# Altium project soldering.PrjPcb
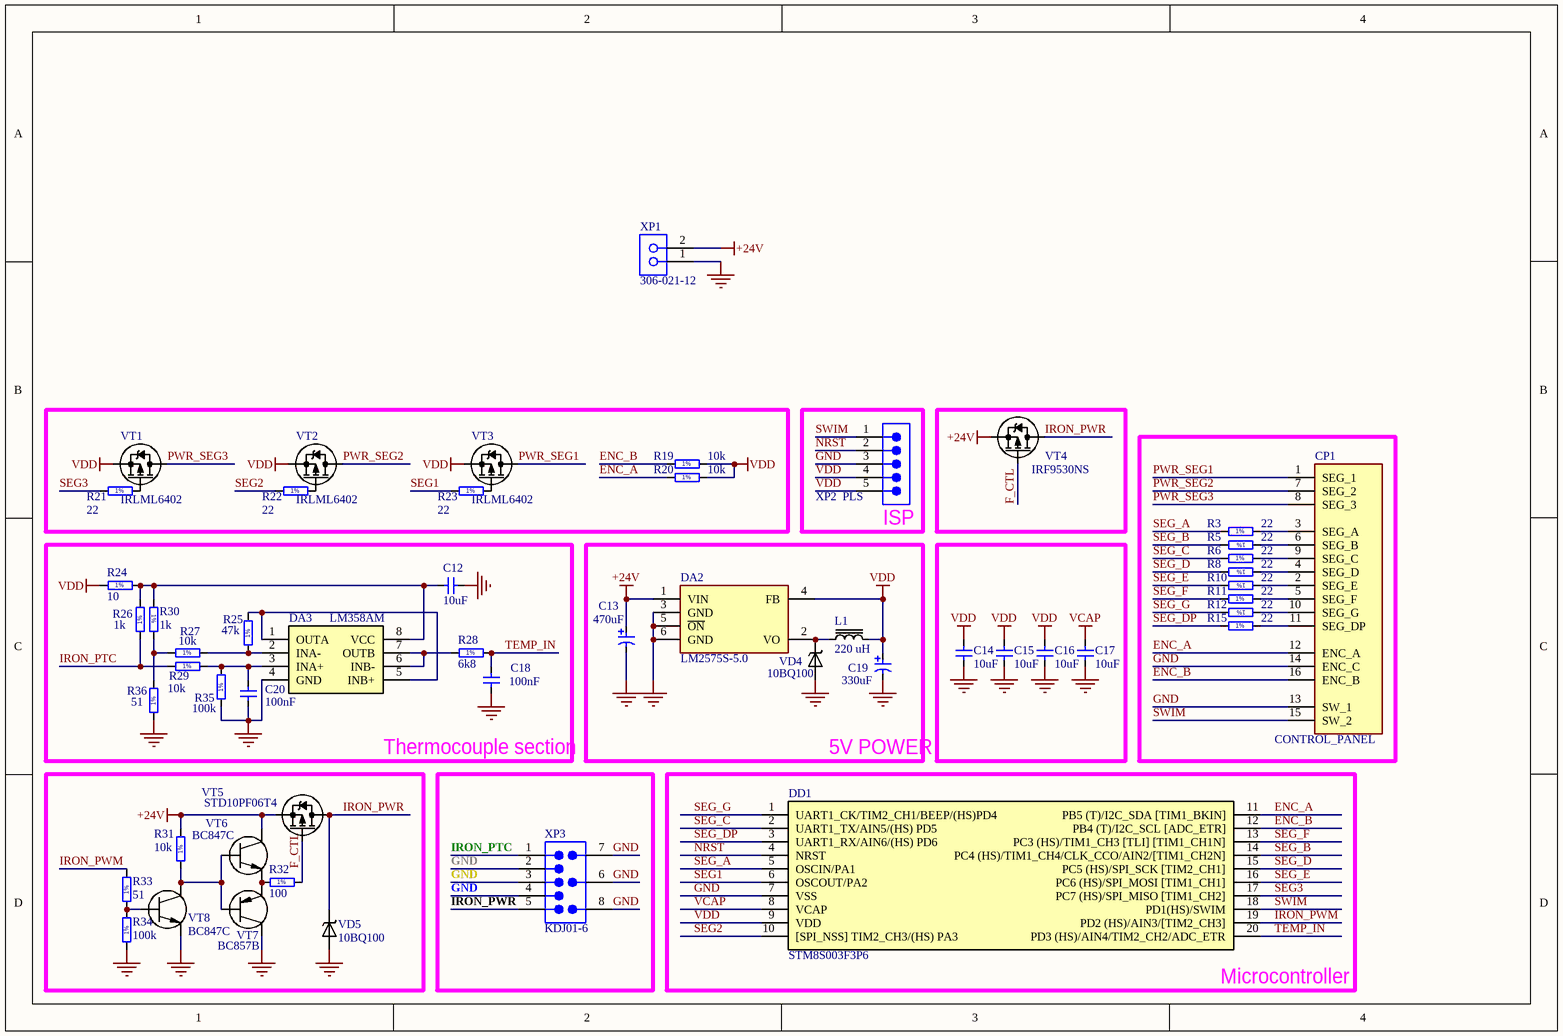
[diagram p0: soldering.SchDoc]
1 sheet, 53 parts. Net scope: global (net labels, ports and power ports of the same name join across sheets).
Board file: soldering.PcbDoc

## Sheet soldering.SchDoc
size A4

### Parts
C12  10uF  [CAP0805R]
C13  470uF  [CAP_EL_10_19_VERT]
C14  10uF  [CAP0805R]
C15  10uF  [CAP0805R]
C16  10uF  [CAP0805R]
C17  10uF  [CAP0805R]
C18  100nF  [CAP0805R]
C19  330uF  [TAN_D]
C20  100nF  [CAP0805R]
CP1  CONTROL_PANEL  [CONTROL_PANEL]
DA2  LM2575S-5.0  [TO-263-5]
DA3  OP Amp  [SOP8]  (value not drawn)
DD1  8 Bit MCU  [TSSOP20]  (value not drawn)
L1  220 uH  [SL1016]
R3  22  [RES0805R]
R5  22  [RES0805R]
R6  22  [RES0805R]
R8  22  [RES0805R]
R10  22  [RES0805R]
R11  22  [RES0805R]
R12  22  [RES0805R]
R15  22  [RES0805R]
R19  10k  [RES0805R]
R20  10k  [RES0805R]
R21  22  [RES0805R]
R22  22  [RES0805R]
R23  22  [RES0805R]
R24  10  [RES0805R]
R25  47k  [RES0805R]
R26  1k  [RES0805R]
R27  10k  [RES0805R]
R28  6k8  [RES0805R]
R29  10k  [RES0805R]
R30  1k  [RES0805R]
R31  10k  [RES0805R]
R32  100  [RES0805R]
R33  51  [RES0805R]
R34  100k  [RES0805R]
R35  100k  [RES0805R]
R36  51  [RES0805R]
VD4  10BQ100  [DO-214AA]
VD5  10BQ100  [DO-214AA]
VT1  IRLML6402  [SOT23]
VT2  IRLML6402  [SOT23]
VT3  IRLML6402  [SOT23]
VT4  IRF9530NS  [D2PAK]
VT5  STD10PF06T4  [DPAK]
VT6  BC847C  [SOT23]
VT7  BC857B  [SOT23]
VT8  BC847C  [SOT23]
XP1  306-021-12  [306-021-12]
XP2  PLS  [PLS-05]
XP3  KDJ01-6  [KDJ01-6]

### Blocks framed on the sheet
ISP: XP2
5V POWER: C13 C19 DA2 L1 VD4
Thermocouple section: R31-R34 VD5 VT5-VT8
Microcontroller: DD1

### Nets
+24V: C13.2 DA2.1(VIN) R31.2 VT4.2(S) VT5.2(S) VT6.3(C) XP1.2
GND: C12.2 C13.1 C14.1 C15.1 C16.1 C17.1 C18.1 C19.1 C20.1 CP1.13(SW_1) CP1.14(ENC_C) DA2.3(GND) DA2.5(~{ON}) DA2.6(GND) DA3.4(GND) DD1.7(VSS) R34.1 R35.1 R36.1 VD4.A VD5.A VT7.3(C) VT8.2(E) XP1.1 XP2.3 XP3.2 XP3.3 XP3.4 XP3.6 XP3.7 XP3.8
VCAP: C17.2 DD1.8(VCAP)
VDD: C14.2 C15.2 C16.2 C19.2 DA2.4(FB) DD1.9(VDD) L1.2 R19.2 R20.2 R24.1 VT1.2(S) VT2.2(S) VT3.2(S) XP2.4 XP2.5
ENC_A: CP1.12(ENC_A) DD1.11(PB5_(T)/I2C_SDA_[TIM1_BKIN]) R20.1
ENC_B: CP1.16(ENC_B) DD1.12(PB4_(T)/I2C_SCL_[ADC_ETR]) R19.1
F_CTL: R32.2 VT4.1(G) VT5.1(G)
IRON_PTC: R26.1 R29.1 XP3.1
IRON_PWM: DD1.19(PD2_(HS)/AIN3/[TIM2_CH3]) R33.2
IRON_PWR: VD5.K VT4.3(D) VT5.3(D) XP3.5
NRST: DD1.4(NRST) XP2.2
PWR_SEG1: CP1.1(SEG_1) VT3.3(D)
PWR_SEG2: CP1.7(SEG_2) VT2.3(D)
PWR_SEG3: CP1.8(SEG_3) VT1.3(D)
SEG1: DD1.6(OSCOUT/PA2) R23.1
SEG2: DD1.10([SPI_NSS]_TIM2_CH3/(HS)_PA3) R22.1
SEG3: DD1.17(PC7_(HS)/SPI_MISO_[TIM1_CH2]) R21.1
SEG_A: DD1.5(OSCIN/PA1) R3.1
SEG_B: DD1.14(PC4_(HS)/TIM1_CH4/CLK_CCO/AIN2/[TIM1_CH2N]) R5.2
SEG_C: DD1.2(UART1_TX/AIN5/(HS)_PD5) R6.1
SEG_D: DD1.15(PC5_(HS)/SPI_SCK_[TIM2_CH1]) R8.2
SEG_DP: DD1.3(UART1_RX/AIN6/(HS)_PD6) R15.1
SEG_E: DD1.16(PC6_(HS)/SPI_MOSI_[TIM1_CH1]) R10.2
SEG_F: DD1.13(PC3_(HS)/TIM1_CH3_[TLI]_[TIM1_CH1N]) R11.1
SEG_G: DD1.1(UART1_CK/TIM2_CH1/BEEP/(HS)PD4) R12.2
SWIM: CP1.15(SW_2) DD1.18(PD1(HS)/SWIM) XP2.1
TEMP_IN: C18.2 DD1.20(PD3_(HS)/AIN4/TIM2_CH2/ADC_ETR) R28.2
NetC12_1: C12.1 DA3.8(VCC) R24.2 R26.2 R30.1
NetC20_2: C20.2 DA3.3(INA+) R29.2 R35.2
NetCP1_2: CP1.2(SEG_E) R10.1
NetCP1_3: CP1.3(SEG_A) R3.2
NetCP1_4: CP1.4(SEG_D) R8.1
NetCP1_5: CP1.5(SEG_F) R11.2
NetCP1_6: CP1.6(SEG_B) R5.1
NetCP1_9: CP1.9(SEG_C) R6.2
NetCP1_10: CP1.10(SEG_G) R12.1
NetCP1_11: CP1.11(SEG_DP) R15.2
NetDA2_2: DA2.2(VO) L1.1 VD4.K
NetDA3_1: DA3.1(OUTA) DA3.5(INB+) R25.2
NetDA3_2: DA3.2(INA-) R25.1 R27.2
NetDA3_6: DA3.6(INB-) DA3.7(OUTB) R28.1
NetR21_2: R21.2 VT1.1(G)
NetR22_2: R22.2 VT2.1(G)
NetR23_2: R23.2 VT3.1(G)
NetR27_1: R27.1 R30.2 R36.2
NetR31_1: R31.1 VT6.1(B) VT7.1(B) VT8.3(C)
NetR32_1: R32.1 VT6.2(E) VT7.2(E)
NetR33_1: R33.1 R34.2 VT8.1(B)

### Notes on the sheet
- (in symbol R0805_1K_1%_0.125W_100PPM) 1%
- (in symbol R0805_6K8_1%_0.125W_100PPM) 1%
- (in symbol R0805_10K_1%_0.125W_100PPM) 1%
- (in symbol R0805_10R_1%_0.125W_200PPM) 1%
- (in symbol R0805_22R_1%_0.125W_100PPM) 1%
- (in symbol R0805_47K_1%_0.125W_100PPM) 1%
- (in symbol R0805_51R_1%_0.125W_100PPM) 1%
- (in symbol R0805_100K_1%_0.125W_100PPM) 1%
- (in symbol R0805_100R_1%_0.125W_100PPM) 1%

### Library data of the parts
C12 C14-C17 = CC0805_10UF_10V_10%_X7R: SMD 0805 Capacitor; Part Description: SMD Multilayer Chip Ceramic Capacitor; Manufacturer: GENERIC; Manufacturer1 Part Number: GRM21BR71A106KE51L; Voltage: 10V; TC: X7R; Tolerance: ±10%; Table: Capacitors SMD; Part Number: CC0805_10UF_10V_10%_X7R; Component Kind: Standard; Component Type: Standard; Pin Count: 2; Value: 10uF; Status: Preferred; Manufacturer Part Number: CC0805_10UF_10V_10%_X7R; Case: 0805; Mounted: Yes; Socket: No; SMD: Yes; Manufacturer1 Example: MURATA; Manufacturer1 ComponentHeight: 1.35mm; HelpURL: \\cern.ch\dfs\Applications\Altium\Datasheets\CC0805_X7R_MURATA.pdf; Author: I. Kuznetsov; CreateDate: 30.04.2012; LatestRevisionDate: 30.04.2012
C13 = SH050M0470B5S-1019 (VERT MOUNTED): Voltage: 50V; Table: Electrolytic THD; Part Number: SH050M0470B5S-1019 (VERT MOUNTED); Value: 470uF
C18 C20 = CC0805_100NF_50V_10%_X7R: SMD 0805 Capacitor; Part Description: SMD Multilayer Chip Ceramic Capacitor; Manufacturer: GENERIC; Manufacturer1 Part Number: B37941K5104K62; Voltage: 50V; TC: X7R; Tolerance: ±10%; Table: Capacitors SMD; Part Number: CC0805_100NF_50V_10%_X7R; Component Kind: Standard; Component Type: Standard; Pin Count: 2; Value: 100nF; Status: Preferred; Manufacturer Part Number: CC0805_100NF_50V_10%_X7R; Case: 0805; Mounted: Yes; Socket: No; SMD: Yes; Manufacturer1 Example: EPCOS; Manufacturer1 ComponentHeight: 1.35mm; HelpURL: \\cern.ch\dfs\Applications\Altium\Datasheets\CC0805_X7R_EPCOS.pdf; Author: I. Kuznetsov; CreateDate: 03.12.2007; LatestRevisionDate: 03.12.2007
C19 = T495D337M010AHE100: Voltage: 10V; Table: Tantalum; Part Number: T495D337M010AHE100; Value: 330uF
DA2 = LM2575S-5.0: Manufacturer: TI; Table: Regulators; Part Number: LM2575S-5.0; Component Kind: Standard; Component Type: Standard; Device: LM2575S-5.0; Status: Active; Manufacturer Part Number: LM2575S-5.0; Pin Count: 6; Case: TO-263-5; Mounted: Yes; Socket: No; SMD: Yes; Author: I. Kuznetsov
DA3 = LM358AM: PartNumber: LM358AM
DD1 = STM8S003F3P6: 8 Bit MCU (STmicroelectronics); PartNumber: STM8S003F3P6
L1 = SL1016T-4R7K-B-N: Tolerance: ± 10%; Table: Inductors THD; Part Number: SL1016T-4R7K-B-N; Value: 220 uH
R3 R5 R6 R8 R10-R12 R15 R21-R23 = R0805_22R_1%_0.125W_100PPM: Part Description: General Purpose Thick Film Chip Resistor; Manufacturer: GENERIC; Manufacturer1 Part Number: NRC10F22R0TRF; Power: 0.125W; TC: ±100ppm/°C; Tolerance: ±1%; Table: Resistors SMD; Part Number: R0805_22R_1%_0.125W_100PPM; Component Kind: Standard; Component Type: Standard; Footprint: RESC2012X60N; Pin Count: 2; Value: 22; Status: Preferred; Manufacturer Part Number: R0805_22R_1%_0.125W_100PPM; Case: 0805; Mounted: Yes; Socket: No; SMD: Yes; Manufacturer1 Example: NIC COMPONENT; Manufacturer1 ComponentHeight: 0.6mm; HelpURL: \\cern.ch\dfs\Applications\Altium\Datasheets\R0805_NIC_NRC.pdf; Author: CERN DEM JLC; CreateDate: 03.12.2007; LatestRevisionDate: 13.03.2008
R19 R20 R27 R29 R31 = R0805_10K_1%_0.125W_100PPM: Part Description: General Purpose Thick Film Chip Resistor; Manufacturer: GENERIC; Manufacturer1 Part Number: NRC10F1002TRF; Power: 0.125W; TC: ±100ppm/°C; Tolerance: ±1%; Table: Resistors SMD; Part Number: R0805_10K_1%_0.125W_100PPM; Component Kind: Standard; Component Type: Standard; Footprint: RESC2012X60N; Pin Count: 2; Value: 10k; Status: Preferred; Manufacturer Part Number: R0805_10K_1%_0.125W_100PPM; Case: 0805; Mounted: Yes; Socket: No; SMD: Yes; Manufacturer1 Example: NIC COMPONENT; Manufacturer1 ComponentHeight: 0.6mm; HelpURL: \\cern.ch\dfs\Applications\Altium\Datasheets\R0805_NIC_NRC.pdf; Author: CERN DEM JLC
  R19 R20 R31: CreateDate: 03.12.2007; LatestRevisionDate: 13.03.2008
  R27 R29: CreateDate: 12/3/2007; LatestRevisionDate: 3/13/2008; PackageDescription: Standard
R24 = R0805_10R_1%_0.125W_200PPM: Part Description: General Purpose Thick Film Chip Resistor; Manufacturer: GENERIC; Manufacturer1 Part Number: NRC10F10R0TRF; Power: 0.125W; TC: ±200ppm/°C; Tolerance: ±1%; Table: Resistors SMD; Part Number: R0805_10R_1%_0.125W_200PPM; Component Kind: Standard; Component Type: Standard; Footprint: RESC2012X60N; Pin Count: 2; Value: 10; Status: Preferred; Manufacturer Part Number: R0805_10R_1%_0.125W_200PPM; Case: 0805; Mounted: Yes; Socket: No; SMD: Yes; Manufacturer1 Example: NIC COMPONENT; Manufacturer1 ComponentHeight: 0.6mm; HelpURL: \\cern.ch\dfs\Applications\Altium\Datasheets\R0805_NIC_NRC.pdf; Author: CERN DEM JLC; CreateDate: 03.12.2007; LatestRevisionDate: 24.06.2009
R25 = R0805_47K_1%_0.125W_100PPM: Part Description: General Purpose Thick Film Chip Resistor; Manufacturer: GENERIC; Manufacturer1 Part Number: NRC10F4702TRF; Power: 0.125W; TC: ±100ppm/°C; Tolerance: ±1%; Table: Resistors SMD; Part Number: R0805_47K_1%_0.125W_100PPM; Component Kind: Standard; Component Type: Standard; Footprint: RESC2012X60N; Pin Count: 2; Value: 47k; Status: Preferred; Manufacturer Part Number: R0805_47K_1%_0.125W_100PPM; Case: 0805; Mounted: Yes; Socket: No; SMD: Yes; Manufacturer1 Example: NIC COMPONENT; Manufacturer1 ComponentHeight: 0.6mm; HelpURL: \\cern.ch\dfs\Applications\Altium\Datasheets\R0805_NIC_NRC.pdf; Author: CERN DEM JLC; CreateDate: 12/3/2007; LatestRevisionDate: 3/13/2008; PackageDescription: Standard
R26 R30 = R0805_1K_1%_0.125W_100PPM: Part Description: General Purpose Thick Film Chip Resistor; Manufacturer: GENERIC; Manufacturer1 Part Number: NRC10F1001TRF; Power: 0.125W; TC: ±100ppm/°C; Tolerance: ±1%; Table: Resistors SMD; Part Number: R0805_1K_1%_0.125W_100PPM; Component Kind: Standard; Component Type: Standard; Footprint: RESC2012X60N; Pin Count: 2; Value: 1k; Status: Preferred; Manufacturer Part Number: R0805_1K_1%_0.125W_100PPM; Case: 0805; Mounted: Yes; Socket: No; SMD: Yes; Manufacturer1 Example: NIC COMPONENT; Manufacturer1 ComponentHeight: 0.6mm; HelpURL: \\cern.ch\dfs\Applications\Altium\Datasheets\R0805_NIC_NRC.pdf; Author: CERN DEM JLC
  R26: CreateDate: 12/3/2007; LatestRevisionDate: 3/13/2008; PackageDescription: Standard
  R30: CreateDate: 03.12.2007; LatestRevisionDate: 13.03.2008
R28 = R0805_6K8_1%_0.125W_100PPM: Part Description: General Purpose Thick Film Chip Resistor; Manufacturer: GENERIC; Manufacturer1 Part Number: NRC10F6801TRF; Power: 0.125W; TC: ±100ppm/°C; Tolerance: ±1%; Table: Resistors SMD; Part Number: R0805_6K8_1%_0.125W_100PPM; Component Kind: Standard; Component Type: Standard; Footprint: RESC2012X60N; Pin Count: 2; Value: 6k8; Status: Preferred; Manufacturer Part Number: R0805_6K8_1%_0.125W_100PPM; Case: 0805; Mounted: Yes; Socket: No; SMD: Yes; Manufacturer1 Example: NIC COMPONENT; Manufacturer1 ComponentHeight: 0.6mm; HelpURL: \\cern.ch\dfs\Applications\Altium\Datasheets\R0805_NIC_NRC.pdf; Author: CERN DEM JLC; CreateDate: 03.12.2007; LatestRevisionDate: 13.03.2008
R32 = R0805_100R_1%_0.125W_100PPM: Part Description: General Purpose Thick Film Chip Resistor; Manufacturer: GENERIC; Manufacturer1 Part Number: NRC10F4700TRF; Power: 0.125W; TC: ±100ppm/°C; Tolerance: ±1%; Table: Resistors SMD; Part Number: R0805_100R_1%_0.125W_100PPM; Component Kind: Standard; Component Type: Standard; Footprint: RESC2012X60N; Pin Count: 2; Value: 100; Status: Preferred; Manufacturer Part Number: R0805_100R_1%_0.125W_100PPM; Case: 0805; Mounted: Yes; Socket: No; SMD: Yes; Manufacturer1 Example: NIC COMPONENT; Manufacturer1 ComponentHeight: 0.6mm; HelpURL: \\cern.ch\dfs\Applications\Altium\Datasheets\R0805_NIC_NRC.pdf; Author: CERN DEM JLC; CreateDate: 03.12.2007; LatestRevisionDate: 13.03.2008
R33 R36 = R0805_51R_1%_0.125W_100PPM: Part Description: General Purpose Thick Film Chip Resistor; Manufacturer: GENERIC; Manufacturer1 Part Number: NRC10F51R0TRF; Power: 0.125W; TC: ±100ppm/°C; Tolerance: ±1%; Table: Resistors SMD; Part Number: R0805_51R_1%_0.125W_100PPM; Component Kind: Standard; Component Type: Standard; Footprint: RESC2012X60N; Pin Count: 2; Value: 51; Status: Preferred; Manufacturer Part Number: R0805_51R_1%_0.125W_100PPM; Case: 0805; Mounted: Yes; Socket: No; SMD: Yes; Manufacturer1 Example: NIC COMPONENT; Manufacturer1 ComponentHeight: 0.6mm; HelpURL: \\cern.ch\dfs\Applications\Altium\Datasheets\R0805_NIC_NRC.pdf; Author: CERN DEM JLC
  R33: CreateDate: 03.12.2007; LatestRevisionDate: 13.03.2008
  R36: CreateDate: 12/3/2007; LatestRevisionDate: 3/13/2008; PackageDescription: Standard
R34 = R0805_100K_1%_0.125W_100PPM: Part Description: General Purpose Thick Film Chip Resistor; Manufacturer: GENERIC; Manufacturer1 Part Number: NRC10F1003TRF; Power: 0.125W; TC: ±100ppm/°C; Tolerance: ±1%; Table: Resistors SMD; Part Number: R0805_100K_1%_0.125W_100PPM; Component Kind: Standard; Component Type: Standard; Footprint: RESC2012X60N; Pin Count: 2; Value: 100k; Status: Preferred; Manufacturer Part Number: R0805_100K_1%_0.125W_100PPM; Case: 0805; Mounted: Yes; Socket: No; SMD: Yes; Manufacturer1 Example: NIC COMPONENT; Manufacturer1 ComponentHeight: 0.6mm; HelpURL: \\cern.ch\dfs\Applications\Altium\Datasheets\R0805_NIC_NRC.pdf; Author: CERN DEM JLC; CreateDate: 03.12.2007; LatestRevisionDate: 13.03.2008
R35 = R0805_100K_1%_0.125W_100PPM: Part Description: General Purpose Thick Film Chip Resistor; Manufacturer: GENERIC; Manufacturer1 Part Number: NRC10F1003TRF; Table: Resistors SMD; Power: 0.125W; TC: ±100ppm/°C; Tolerance: ±1%; Part Number: R0805_100K_1%_0.125W_100PPM; Component Kind: Standard; Component Type: Standard; Footprint: RESC2012X60N; Pin Count: 2; Value: 100k; Status: Preferred; Manufacturer Part Number: R0805_100K_1%_0.125W_100PPM; Case: 0805; Mounted: Yes; Socket: No; SMD: Yes; Manufacturer1 Example: NIC COMPONENT; Manufacturer1 ComponentHeight: 0.6mm; HelpURL: \\cern.ch\dfs\Applications\Altium\Datasheets\R0805_NIC_NRC.pdf; Author: CERN DEM JLC; CreateDate: 12/3/2007; LatestRevisionDate: 3/13/2008; PackageDescription: Standard
VD4 VD5 = 10BQ100: Manufacturer: IR; Table: Diode; Part Number: 10BQ100; Component Kind: Standard; Component Type: Standard; Device: 10BQ100; Footprint: SMB; Status: Active; Manufacturer Part Number: 10BQ100; Pin Count: 2; Case: SMB; Mounted: Yes; Socket: No; SMD: Yes; Author: I. Kuznetsov
VT1-VT3 = IRLML6402: Part Description: MOSFET P-канал 20В/3.7А/1.3Вт/0.065 Ом; Table: Transistors; Part Number: IRLML6402; Component Kind: Standard; Component Type: Standard; Device: IRLML6402; Status: Active; Case: SOT23; Mounted: Yes; Socket: No; SMD: Yes; Author: I. Kuznetsov
VT4 = IRF9530NS: Part Description: MOSFET P-канал 100В/14А/79Вт/0.2 Ом; Table: Transistors; Part Number: IRF9530NS; Device: IRF9530NS
VT5 = STD10PF06T4: Part Description: MOSFET P-канал 60В/10А/40Вт/0.032 Ом; Table: Transistors; Part Number: STD10PF06T4; Device: STD10PF06T4; Case: DPAK; Author: I. Kuznetsov
VT6 VT8 = BC847C: Part Description: NPN 45В/0.1А Кус.=420-800; Table: Transistors; Part Number: BC847C; Component Kind: Standard; Component Type: Standard; Device: BC847C; Status: Active; Case: SOT23; Mounted: Yes; Socket: No; SMD: Yes; Author: I. Kuznetsov
VT7 = BC857B: Part Description: PNP 45В/0.1А Кус.=200-450; Table: Transistors; Part Number: BC857B; Component Kind: Standard; Component Type: Standard; Device: BC857B; Status: Active; Case: SOT23; Mounted: Yes; Socket: No; SMD: Yes; Author: I. Kuznetsov
XP1 = 306-021-12: Table: DEGSON; Part Number: 306-021-12; Family: DG306; Device: 306-021-12; ComponentLink1URL: http://www.promelec.ru/pdf/305,306.pdf
XP2 = PLS-05: Manufacturer: AUK; Part Number: PLS-05; Component Kind: Standard; Component Type: Standard; PackageDescription: PLS-05; Pin Count: 5; Family: PLS; SMD: Yes; Manufacturer Part Number: PLS-05; Table: AUK
XP3 = KDJ01-6: Table: OTHER; Part Number: KDJ01-6; Family: KDJ01-6; Device: KDJ01-6

## Assembly variants
VAR1: not fitted VT1